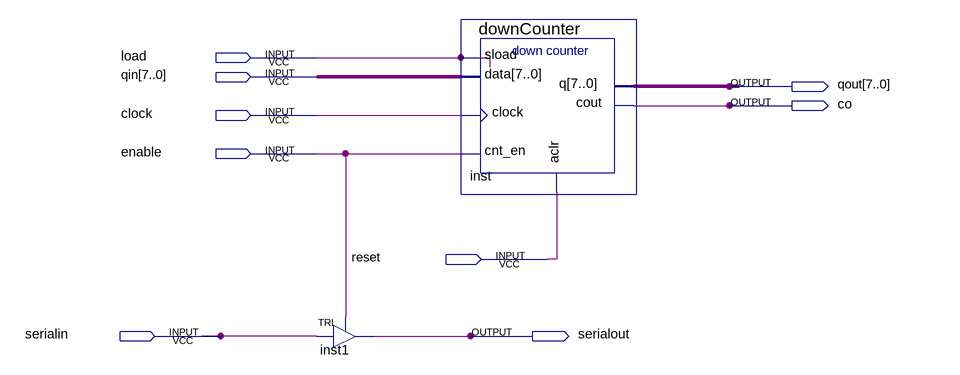
[diagram p0: schematic sheet]
// Quartus schematic transmitter.bdf as structural Verilog: 2 symbols, 9 pins
module transmitter (
  input  load,
  input  [7:0] qin,
  input  clock,
  input  enable,
  input  reset,
  input  serialin,
  output [7:0] qout,
  output co,
  output serialout
);

  TRI inst1 (.IN(serialin), .OE(enable), .OUT(serialout));
  downCounter inst (.sload(load), .data(qin), .clock(clock), .cnt_en(enable), .aclr(reset), .cout(co), .q(qout));
endmodule
